# Altium project 200103 Brake Module R1.PrjPcb
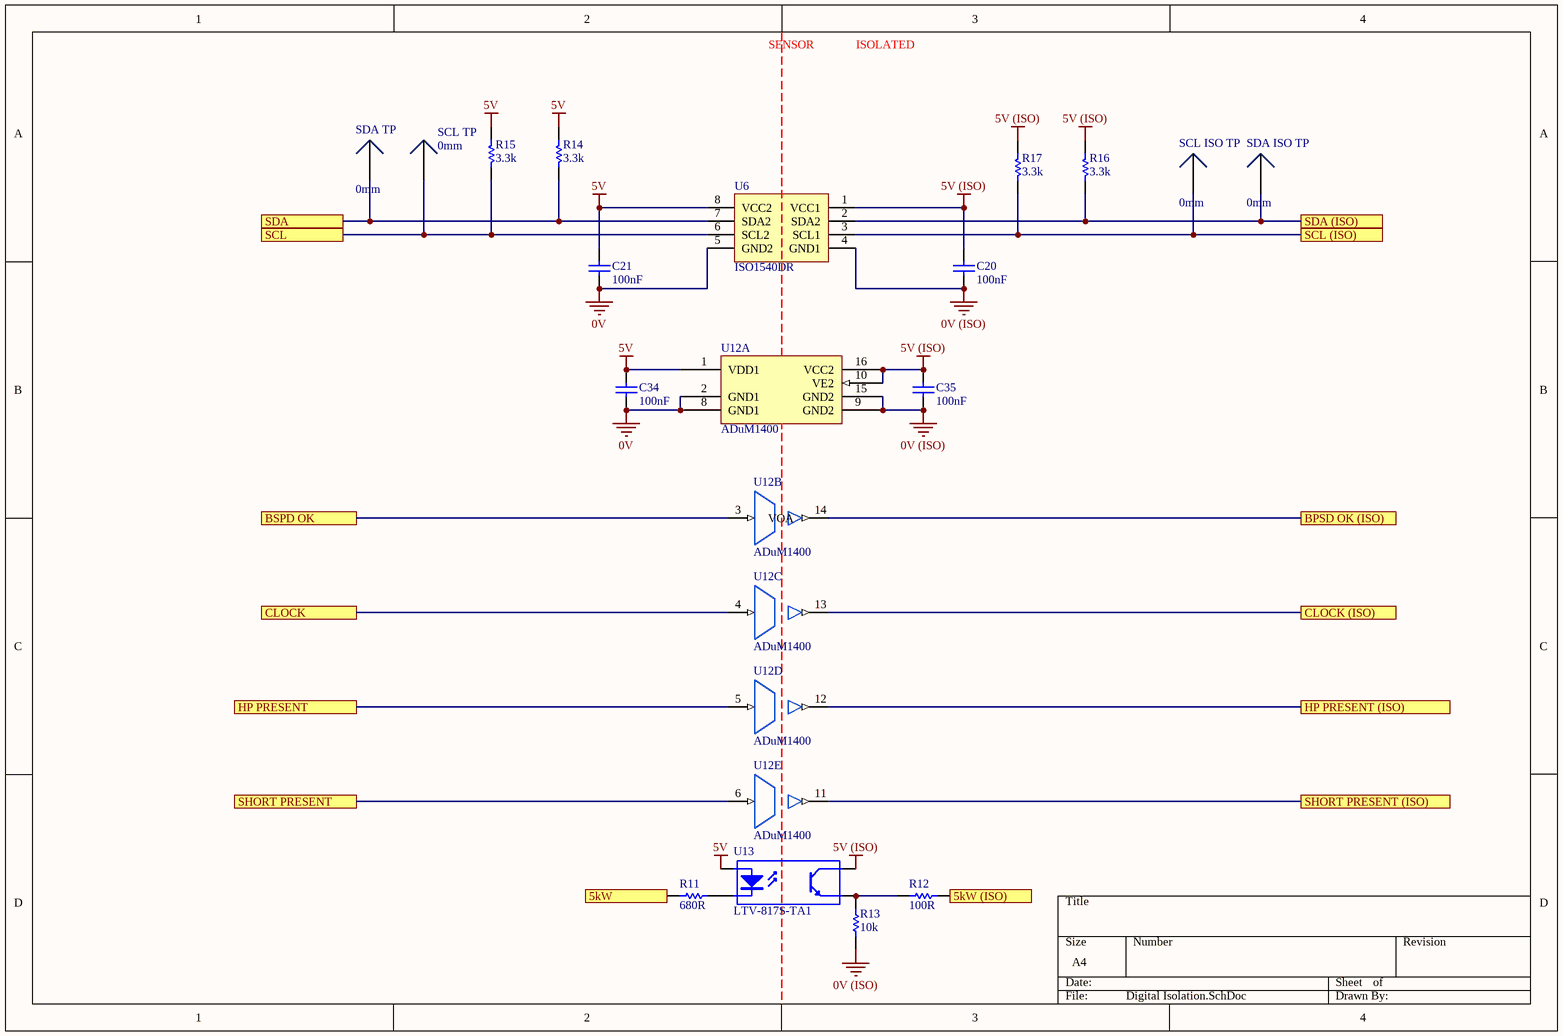
[diagram p0: Digital Isolation.SchDoc]
1 sheet, 18 parts. Net scope: flat (ports and power ports of the same name join across sheets).
Board file: Brake Module PCB.PcbDoc

## Sheet Digital Isolation.SchDoc
size A4

### Parts
C20  100nF  [0805]
C21  100nF  [0805]
C34  100nF  [0805]
C35  100nF  [0805]
R11  680R  [0805]
R12  100R  [0805]
R13  10k  [0805]
R14  3.3k  [0805]
R15  3.3k  [0805]
R16  3.3k  [0805]
R17  3.3k  [0805]
SCL_ISO_TP  0mm  [SMD Test Point]
SCL_TP  0mm  [SMD Test Point]
SDA_ISO_TP  0mm  [SMD Test Point]
SDA_TP  0mm  [SMD Test Point]
U6  ISO1540DR  [TI 8-SOIC]
U12  ADuM1400  [AD 16-SOIC]  (parts A,B,C,D,E of 5)
U13  LTV-817S-TA1  [ON 4-SMD]

### Ports
5kW, 5kW (ISO), BPSD OK (ISO), BSPD OK, CLOCK, CLOCK (ISO), HP PRESENT, HP PRESENT (ISO), SCL, SCL (ISO), SDA, SDA (ISO), SHORT PRESENT, SHORT PRESENT (ISO)

### Nets
0V: C21.1 C34.1 U6.5(GND2) U12.2(GND1) U12.8(GND1)
0V (ISO): C20.1 C35.1 R13.1 U6.4(GND1) U12.9(GND2) U12.15(GND2)
5V: C21.2 C34.2 R14.2 R15.2 U6.8(VCC2) U12.1(VDD1) U13.1(A)
5V (ISO): C20.2 C35.2 R16.2 R17.2 U6.1(VCC1) U12.10(VE2) U12.16(VCC2) U13.4(C)
NetR11_1: R11.1 U13.2(K)
NetR11_2: R11.2 ; port 5kW
NetR12_1: R12.1 R13.2 U13.3(E)
NetR12_2: R12.2 ; port 5kW (ISO)
NetR14_1: R14.1 SDA_TP.1 U6.7(SDA2) ; port SDA
NetR15_1: R15.1 SCL_TP.1 U6.6(SCL2) ; port SCL
NetR16_1: R16.1 SDA_ISO_TP.1 U6.2(SDA2) ; port SDA (ISO)
NetR17_1: R17.1 SCL_ISO_TP.1 U6.3(SCL1) ; port SCL (ISO)
NetU12_3: U12.3(VIA) ; port BSPD OK
NetU12_4: U12.4(VIB) ; port CLOCK
NetU12_5: U12.5(VIC) ; port HP PRESENT
NetU12_6: U12.6(VID) ; port SHORT PRESENT
NetU12_11: U12.11(VOD) ; port SHORT PRESENT (ISO)
NetU12_12: U12.12(VOC) ; port HP PRESENT (ISO)
NetU12_13: U12.13(VOB) ; port CLOCK (ISO)
NetU12_14: U12.14(VOA) ; port BPSD OK (ISO)

### Notes on the sheet
- SENSOR
- ISOLATED

### Library data of the parts
C20 C21 C34 C35 = GCM21BR71E104KA37L: Manufacturer: muRata; Tolerance: 10%; Material: X7R; Rated Voltage: 25V; Part Number: GCM21BR71E104KA37L; Value: 100nF
R11 = RC0805FR07680RL: Manufacturer: YAGEO; Tolerance: 0.01; Rated Voltage: 0.125W; Part Number: RC0805FR07680RL; Value: 680R; Material: FR-07
R12 = RC0805FR07100RL: Manufacturer: YAGEO; Tolerance: 0.01; Rated Voltage: 0.125W; Part Number: RC0805FR07100RL; Value: 100R; Material: FR-07
R13 = RC0805FR0710KL: Manufacturer: YAGEO; Tolerance: 0.01; Rated Voltage: 0.125W; Part Number: RC0805FR0710KL; Value: 10k; Material: FR-07
R14-R17 = RC0805FR073K3L: Manufacturer: YAGEO; Tolerance: 0.01; Rated Voltage: 0.125W; Part Number: RC0805FR073K3L; Value: 3.3k; Material: FR-07
SCL_ISO_TP SCL_TP SDA_ISO_TP SDA_TP = SMD Test Point: Positions: 1; Row Spacing: 0; Flange: No; Contact: NA; Part Number: SMD Test Point; Pitch: 0mm; Angle: 0
U6 = ISO1540DR: I2C Digital Isolator (Multichannel); Manufacturer: Texas Instruments; Part Number: ISO1540DR; Digikey Part Number: 296-34871-1-ND; Digikey Link: https://www.digikey.com/product-detail/en/texas-instruments/ISO1540DR/296-34871-1-ND/3587214
U12 = ADuM1400: General Purpose Digital Isolator 2500Vrms 4 Channel 1Mbps 25kV/µs CMTI 16-SOIC (0.295", 7.50mm Width); Manufacturer: Analog Devices; Part Number: ADuM1400; Digikey Part Number: ADUM1400WSRWZ-ND; Digikey Link: https://www.digikey.com/product-detail/en/analog-devices-inc/ADUM1400WSRWZ/ADUM1400WSRWZ-ND/1873713
U13 = LTV-817S-TA1: 35V 50ma Optocoupler (VF=1.2V); Manufacturer: Lite-On Inc; Part Number: LTV-817S-TA1; Digikey Part Number: 160-1893-2-ND; Digikey Link: https://www.digikey.com/product-detail/en/lite-on-inc/LTV-817S-TA1/160-1893-2-ND/388451